# EAGLE schematic Tic_Tac_Toe_ (EAGLE 9.6.2)
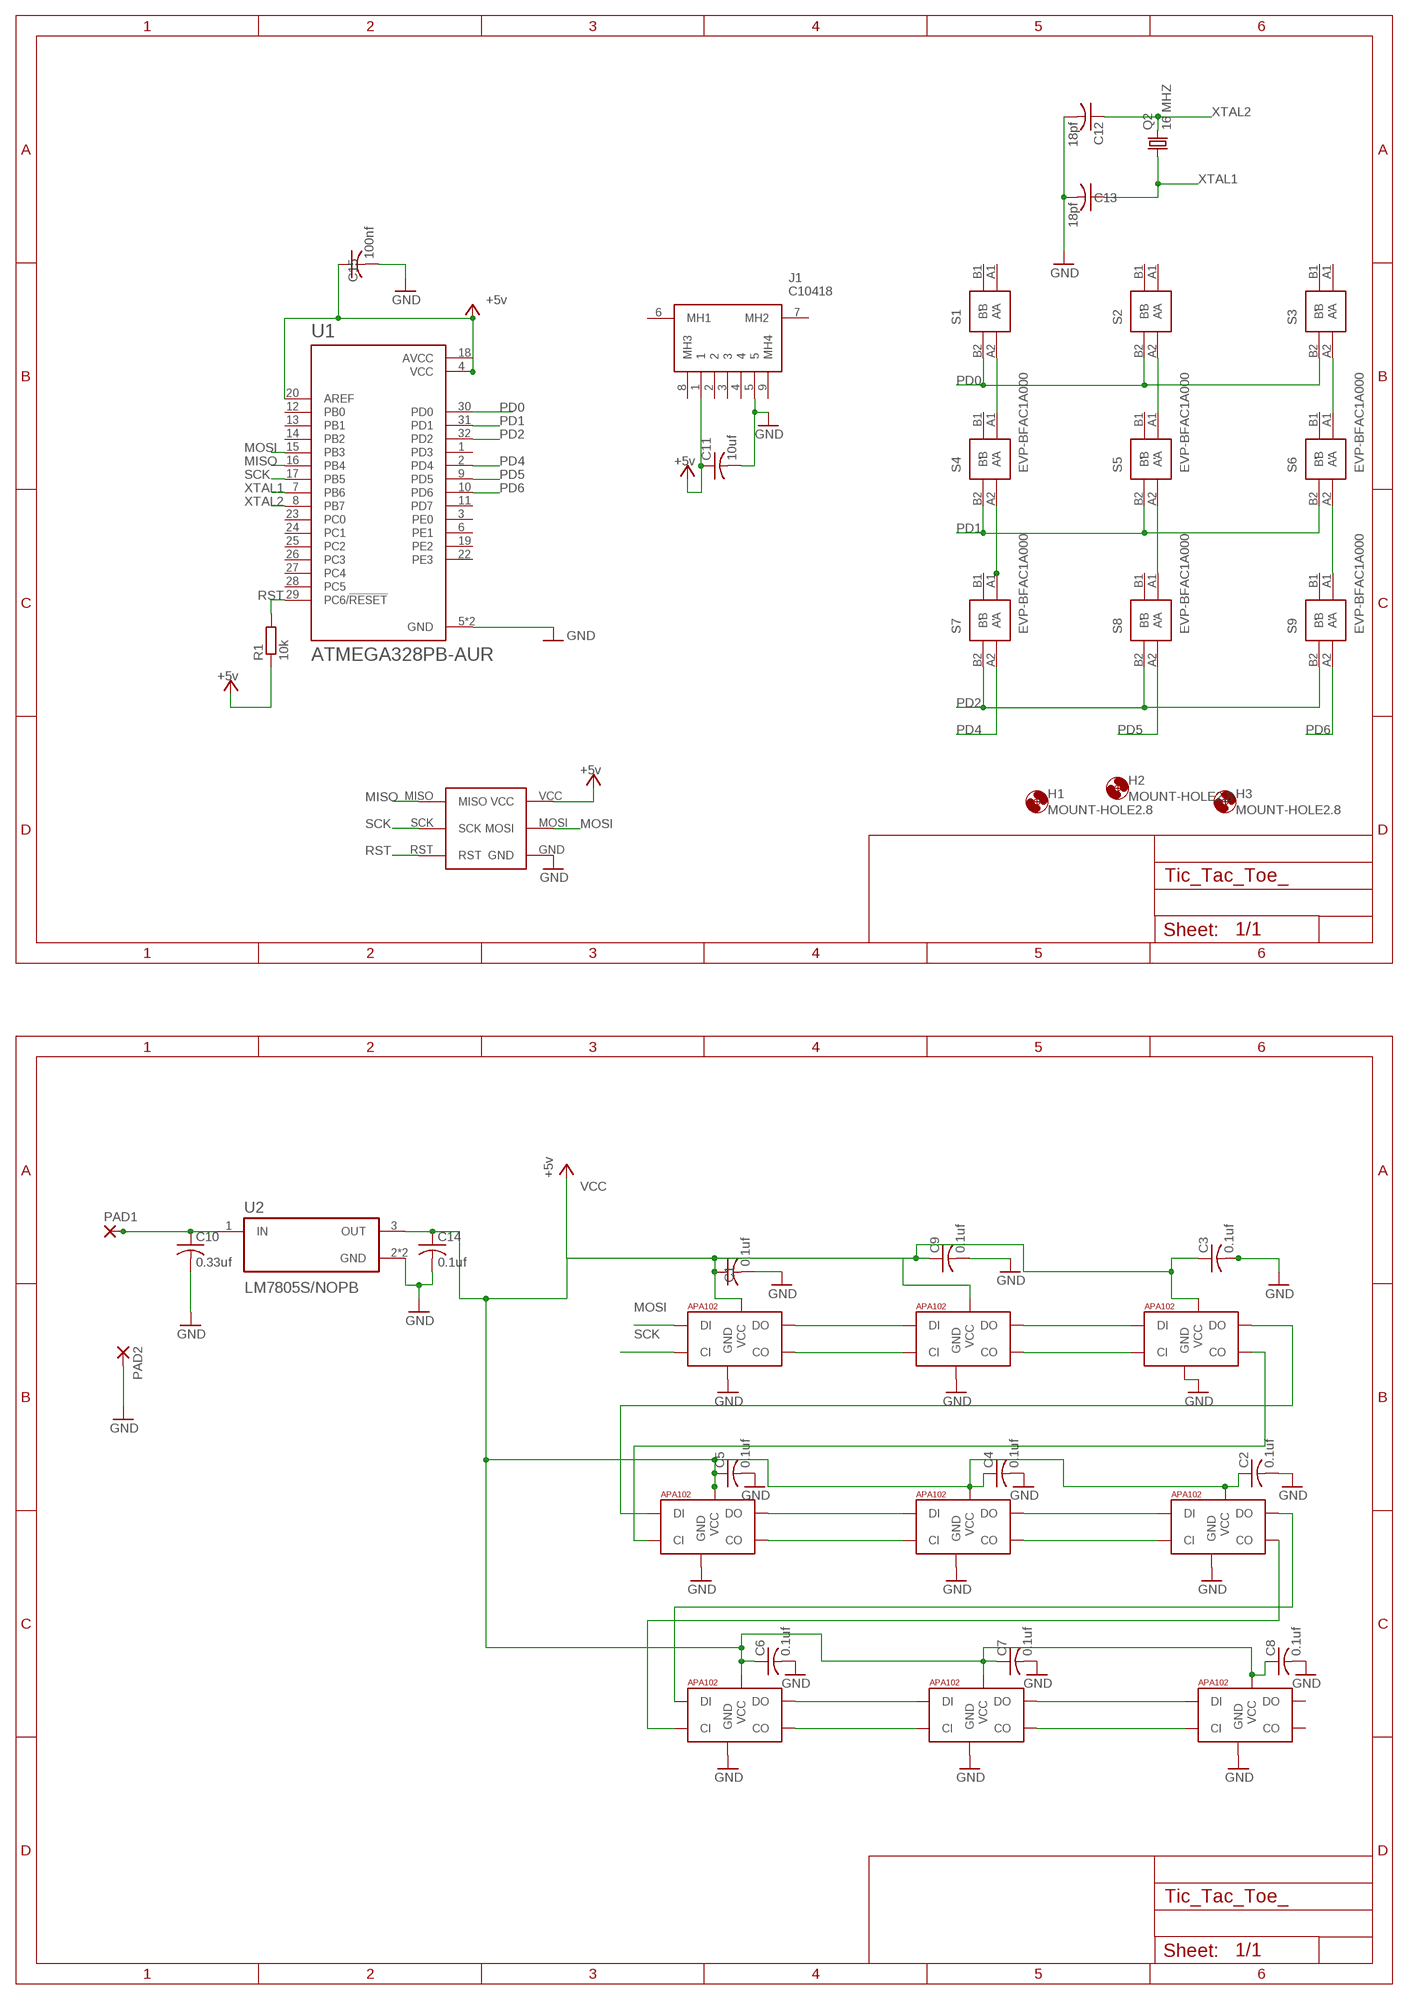
[diagram p0: schematic, sheet 1]

## Parts
C1  0.1uf  C-USC0805  [C0805]
C2  0.1uf  C-USC0805  [C0805]
C3  0.1uf  C-USC0805  [C0805]
C4  0.1uf  C-USC0805  [C0805]
C5  0.1uf  C-USC0805  [C0805]
C6  0.1uf  C-USC0805  [C0805]
C7  0.1uf  C-USC0805  [C0805]
C8  0.1uf  C-USC0805  [C0805]
C9  0.1uf  C-USC0805  [C0805]
C10  0.33uf  C-USC0805  [C0805]
C11  10uf  C-USC0805  [C0805]
C12  18pf  C-USC0805  [C0805]
C13  18pf  C-USC0805  [C0805]
C14  0.1uf  C-USC0805  [C0805]
C15  100nf  C-USC0805  [C0805]
H1  MOUNT-HOLE2.8  [2,8]
H2  MOUNT-HOLE2.8  [2,8]
H3  MOUNT-HOLE2.8  [2,8]
J1  C10418  [C10418]
PAD1  2,15/1,0  [2,15/1,0]
PAD2  2,15/1,0  [2,15/1,0]
Q2  16 MHZ  CRYSTALHC49UP  [HC49UP]
R1  10k  R-EU_M0805  [M0805]
S1  EVP-BFAC1A000  [EVPBFAC1A000]
S2  EVP-BFAC1A000  [EVPBFAC1A000]
S3  EVP-BFAC1A000  [EVPBFAC1A000]
S4  EVP-BFAC1A000  [EVPBFAC1A000]
S5  EVP-BFAC1A000  [EVPBFAC1A000]
S6  EVP-BFAC1A000  [EVPBFAC1A000]
S7  EVP-BFAC1A000  [EVPBFAC1A000]
S8  EVP-BFAC1A000  [EVPBFAC1A000]
S9  EVP-BFAC1A000  [EVPBFAC1A000]
U1  ATMEGA328PB-AUR  [QFP80P900X900X120-32N]
U2  LM7805S/NOPB  [TO254P1524X483-4N]
U$1  AVR-ISP  [AVR-ISP]
U$2  APA1025050  [APA102_5050]
U$3  APA1025050  [APA102_5050]
U$4  APA1025050  [APA102_5050]
U$5  APA1025050  [APA102_5050]
U$6  APA1025050  [APA102_5050]
U$7  APA1025050  [APA102_5050]
U$8  APA1025050  [APA102_5050]
U$9  APA1025050  [APA102_5050]
U$10  APA1025050  [APA102_5050]

## Nets
GND: C1.2 C2.2 C3.2 C4.2 C5.2 C6.2 C7.2 C8.2 C9.2 C10.2 C11.2 C12.2 C13.2 C14.2 C15.2 J1.5 PAD2.1(P) U1.5(GND) U1.21(GND) U2.2(GND) U2.4(GND) U$1.GND U$2.6(GND) U$3.6(GND) U$4.6(GND) U$5.6(GND) U$6.6(GND) U$7.6(GND) U$8.6(GND) U$9.6(GND) U$10.6(GND)
MISO: U1.16(PB4) U$1.MISO
MOSI: U1.15(PB3) U$1.MOSI U$2.4(DI)
N$4: C10.1 PAD1.1(P) U2.1(IN)
N$5: U$2.3(DO) U$3.4(DI)
N$6: U$2.2(CO) U$3.5(CI)
N$7: U$3.3(DO) U$4.4(DI)
N$8: U$3.2(CO) U$4.5(CI)
N$11: U$8.3(DO) U$9.4(DI)
N$15: S1.A2(A') S4.A1(A)
N$16: S6.A2(A') S9.A1(A)
N$19: S4.A2(A') S7.A1(A)
N$23: S2.A2(A') S5.A1(A)
N$24: S5.A2(A') S8.A1(A)
N$26: S3.A2(A') S6.A1(A)
N$34: U$4.3(DO) U$5.4(DI)
N$35: U$4.2(CO) U$5.5(CI)
N$36: U$5.3(DO) U$6.4(DI)
N$37: U$5.2(CO) U$6.5(CI)
N$38: U$6.3(DO) U$7.4(DI)
N$39: U$6.2(CO) U$7.5(CI)
N$40: U$8.2(CO) U$9.5(CI)
N$41: U$9.3(DO) U$10.4(DI)
N$42: U$9.2(CO) U$10.5(CI)
N$46: U$7.2(CO) U$8.5(CI)
N$47: U$7.3(DO) U$8.4(DI)
PD0: S1.B2(B') S2.B2(B') S3.B2(B') U1.30(PD0)
PD1: S4.B2(B') S5.B2(B') S6.B2(B') U1.31(PD1)
PD2: S7.B2(B') S8.B2(B') S9.B2(B') U1.32(PD2)
PD4: S7.A2(A') U1.2(PD4)
PD5: S8.A2(A') U1.9(PD5)
PD6: S9.A2(A') U1.10(PD6)
RST: R1.2 U1.29(PC6/!RESET) U$1.RST
SCK: U1.17(PB5) U$1.SCK U$2.5(CI)
VCC: C1.1 C2.1 C3.1 C4.1 C5.1 C6.1 C7.1 C8.1 C9.1 C11.1 C14.1 C15.1 J1.1 R1.1 U1.4(VCC) U1.18(AVCC) U1.20(AREF) U2.3(OUT) U$1.VCC U$2.1(VCC) U$3.1(VCC) U$4.1(VCC) U$5.1(VCC) U$6.1(VCC) U$7.1(VCC) U$8.1(VCC) U$9.1(VCC) U$10.1(VCC) ; supply symbol labelled +5v
XTAL1: C13.1 Q2.1 U1.7(PB6)
XTAL2: C12.1 Q2.2 U1.8(PB7)
Unconnected: J1.2 J1.3 J1.4 J1.6(MH1) J1.7(MH2) J1.8(MH3) J1.9(MH4) S1.A1(A) S1.B1(B) S2.A1(A) S2.B1(B) S3.A1(A) S3.B1(B) S4.B1(B) S5.B1(B) S6.B1(B) S7.B1(B) S8.B1(B) S9.B1(B) U1.1(PD3) U1.3(PE0) U1.6(PE1) U1.11(PD7) U1.12(PB0) U1.13(PB1) U1.14(PB2) U1.19(PE2) U1.22(PE3) U1.23(PC0) U1.24(PC1) U1.25(PC2) U1.26(PC3) U1.27(PC4) U1.28(PC5) U$10.2(CO) U$10.3(DO)

## Library data of the parts
C1-C15 = rcl:C-US: CAPACITOR, American symbol; SPICEPREFIX: C
H1-H3 = holes:MOUNT-HOLE: MOUNTING HOLE with drill center marker
J1 = C10418:C10418: USB Connectors SMD RoHS Source: Datasheet <https://datasheet.lcsc.com/szlcsc/Jing-Extension-of-the-Electronic-Co-LCSC-MICRO-USB-5S-B-Type-horns-High-temperature_C10418.pdf>; DESCRIPTION: USB Connectors SMD RoHS; HEIGHT: 3mm; MANUFACTURER_NAME: Jing Extension of the Electronic Co.; MANUFACTURER_PART_NUMBER: C10418
PAD1 PAD2 = wirepad:2,15/1,0: THROUGH-HOLE PAD
Q2 = crystal:CRYSTAL: CRYSTAL; OC_FARNELL: unknown; OC_NEWARK: unknown
R1 = rcl:R-EU_: RESISTOR, European symbol; SPICEPREFIX: R
S1-S9 = EVP-BFAC1A000:EVP-BFAC1A000: Tactile Switches 6.0x6.0x3.4mm 2N w/4 Term .25mm Trvl IP67 Source: Datasheet <https://industrial.panasonic.com/cdbs/www-data/pdf/ATK0000/ATK0000C432.pdf> Check prices <https://pricing.snapeda.com/parts/EVP-BFAC1A000/Panasonic%20Electronic/view-part?ref=eda>; AVAILABILITY: Warning; DESCRIPTION: Tactile Switch SPST-NO Top Actuated Surface Mount; MF: Panasonic Electronic; MP: EVP-BFAC1A000; PACKAGE: None; PRICE: None; PURCHASE-URL: https://pricing.snapeda.com/search/part/EVP-BFAC1A000/?ref=eda
U1 = ATMEGA328PB-AUR:ATMEGA328PB-AUR: ATmega Series 20 MHz 32 KB Flash 2 KB SRAM 8-Bit Microcontroller - TQFP-32; DESCRIPTION: AVR AVR® ATmega Microcontroller IC 8-Bit 20MHz 32KB (16K x 16) FLASH 32-TQFP (7x7); DIGI-KEY_PART_NUMBER: ATMEGA328PB-AURCT-ND; MF: Microchip; MP: ATMEGA328PB-AUR; PACKAGE: TQFP-32 Microchip; PURCHASE-URL: https://pricing.snapeda.com/search/part/ATMEGA328PB-AUR/?ref=eda
U2 = LM7805S_NOPB:LM7805S/NOPB: Check prices <https://pricing.snapeda.com/parts/LM7805S/NOPB/Texas%20Instruments/view-part?ref=eda>; AVAILABILITY: Warning; DESCRIPTION: 1.5-A, 30-V, linear voltage regulator 3-DDPAK/TO-263 0 to 125; MF: Texas Instruments; MP: LM7805S/NOPB; PACKAGE: TO-263-3 Texas Instruments; PRICE: None; PURCHASE-URL: https://pricing.snapeda.com/search/part/LM7805S/NOPB/?ref=eda
U$1 = AVR-ISP:AVR-ISP: Check prices <https://pricing.snapeda.com/search/part/AVR-ISP/?ref=eda>; AVAILABILITY: Bad; DESCRIPTION: Emulators / Simulators AVR USB IN CIRCUIT EMUL/PRGMR ISP; MF: Gravitech; MP: AVR-ISP; PACKAGE: None; PRICE: None
U$2-U$10 = jos-ph:APA102: APA102C 5050 RGB LED -- Adafruit DotStar Single LED Pixel Product Page: https://www.adafruit.com/products/2343 Datasheet: https://cdn-shop.adafruit.com/product-files/2343/APA102C.pdf